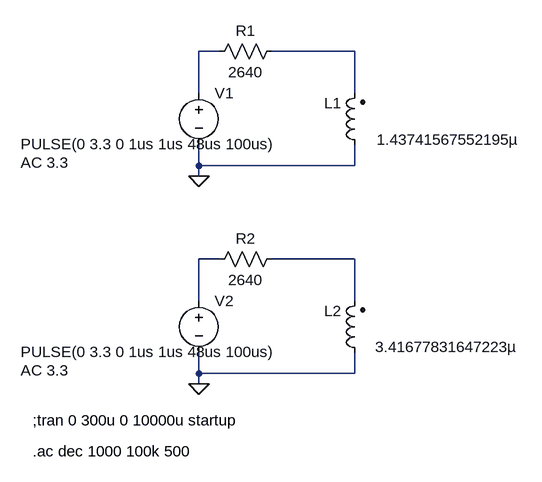
[diagram p0: schematic theory of operation.asc]
theory of operation.asc, the LTspice schematic file:
Version 4
SHEET 1 880 680
WIRE -96 -48 -128 -48
WIRE 112 -48 -16 -48
WIRE -128 16 -128 -48
WIRE 112 16 112 -48
WIRE -128 128 -128 96
WIRE 112 128 112 96
WIRE 112 128 -128 128
WIRE -128 144 -128 128
WIRE -96 272 -128 272
WIRE 112 272 -16 272
WIRE -128 336 -128 272
WIRE 112 336 112 272
WIRE -128 448 -128 416
WIRE 112 448 112 416
WIRE 112 448 -128 448
WIRE -128 464 -128 448
FLAG -128 144 0
FLAG -128 464 0
SYMBOL ind2 128 112 R180
WINDOW 0 36 80 Left 2
WINDOW 3 -240 24 Left 2
SYMATTR InstName L1
SYMATTR Value 1.43741567552195µ
SYMATTR Type ind
SYMATTR SpiceLine Rser=24.6255310947963n Cpar=91.7122498180724p
SYMBOL voltage -128 0 R0
WINDOW 3 -274 95 Left 2
WINDOW 123 -274 123 Left 2
WINDOW 39 0 0 Left 2
SYMATTR InstName V1
SYMATTR Value PULSE(0 3.3 0 1us 1us 48us 100us)
SYMATTR Value2 AC 3.3
SYMBOL ind2 128 432 R180
WINDOW 0 36 80 Left 2
WINDOW 3 -238 25 Left 2
SYMATTR InstName L2
SYMATTR Value 3.41677831647223µ
SYMATTR Type ind
SYMATTR SpiceLine Rser=24.6255310947963n Cpar=91.7122498180724p
SYMBOL res 0 -64 R90
WINDOW 0 0 56 VBottom 2
WINDOW 3 32 56 VTop 2
SYMATTR InstName R1
SYMATTR Value 2640
SYMBOL res 0 256 R90
WINDOW 0 0 56 VBottom 2
WINDOW 3 32 56 VTop 2
SYMATTR InstName R2
SYMATTR Value 2640
SYMBOL voltage -128 320 R0
WINDOW 3 -274 95 Left 2
WINDOW 123 -274 123 Left 2
WINDOW 39 0 0 Left 2
SYMATTR InstName V2
SYMATTR Value PULSE(0 3.3 0 1us 1us 48us 100us)
SYMATTR Value2 AC 3.3
TEXT -384 520 Left 2 !;tran 0 300u 0 10000u startup
TEXT -384 568 Left 2 !.ac dec 1000 100k 500

The netlist it stands for:
* theory of operation.asc
L1 0 N002 1.43741567552195µ Rser=24.6255310947963n Cpar=91.7122498180724p
V1 N001 0 PULSE(0 3.3 0 1us 1us 48us 100us) AC 3.3
L2 0 N004 3.41677831647223µ Rser=24.6255310947963n Cpar=91.7122498180724p
R1 N002 N001 2640
R2 N004 N003 2640
V2 N003 0 PULSE(0 3.3 0 1us 1us 48us 100us) AC 3.3
;tran 0 300u 0 10000u startup
.ac dec 1000 100k 500
.backanno
.end